# EasyEDA Pro project 串口模块.epro, schematic 车载普通串口V1
Board Name: 车载普通串口V1; Create Date: 2025-07-07; Page Name: P1; Project Name: 串口模块（普通串口未开发）; Schematic Name: 车载普通串口V1; Update Date: 2025-07-07; Company: 嘉立创EDA; Page Size: A4; Version: V1.0
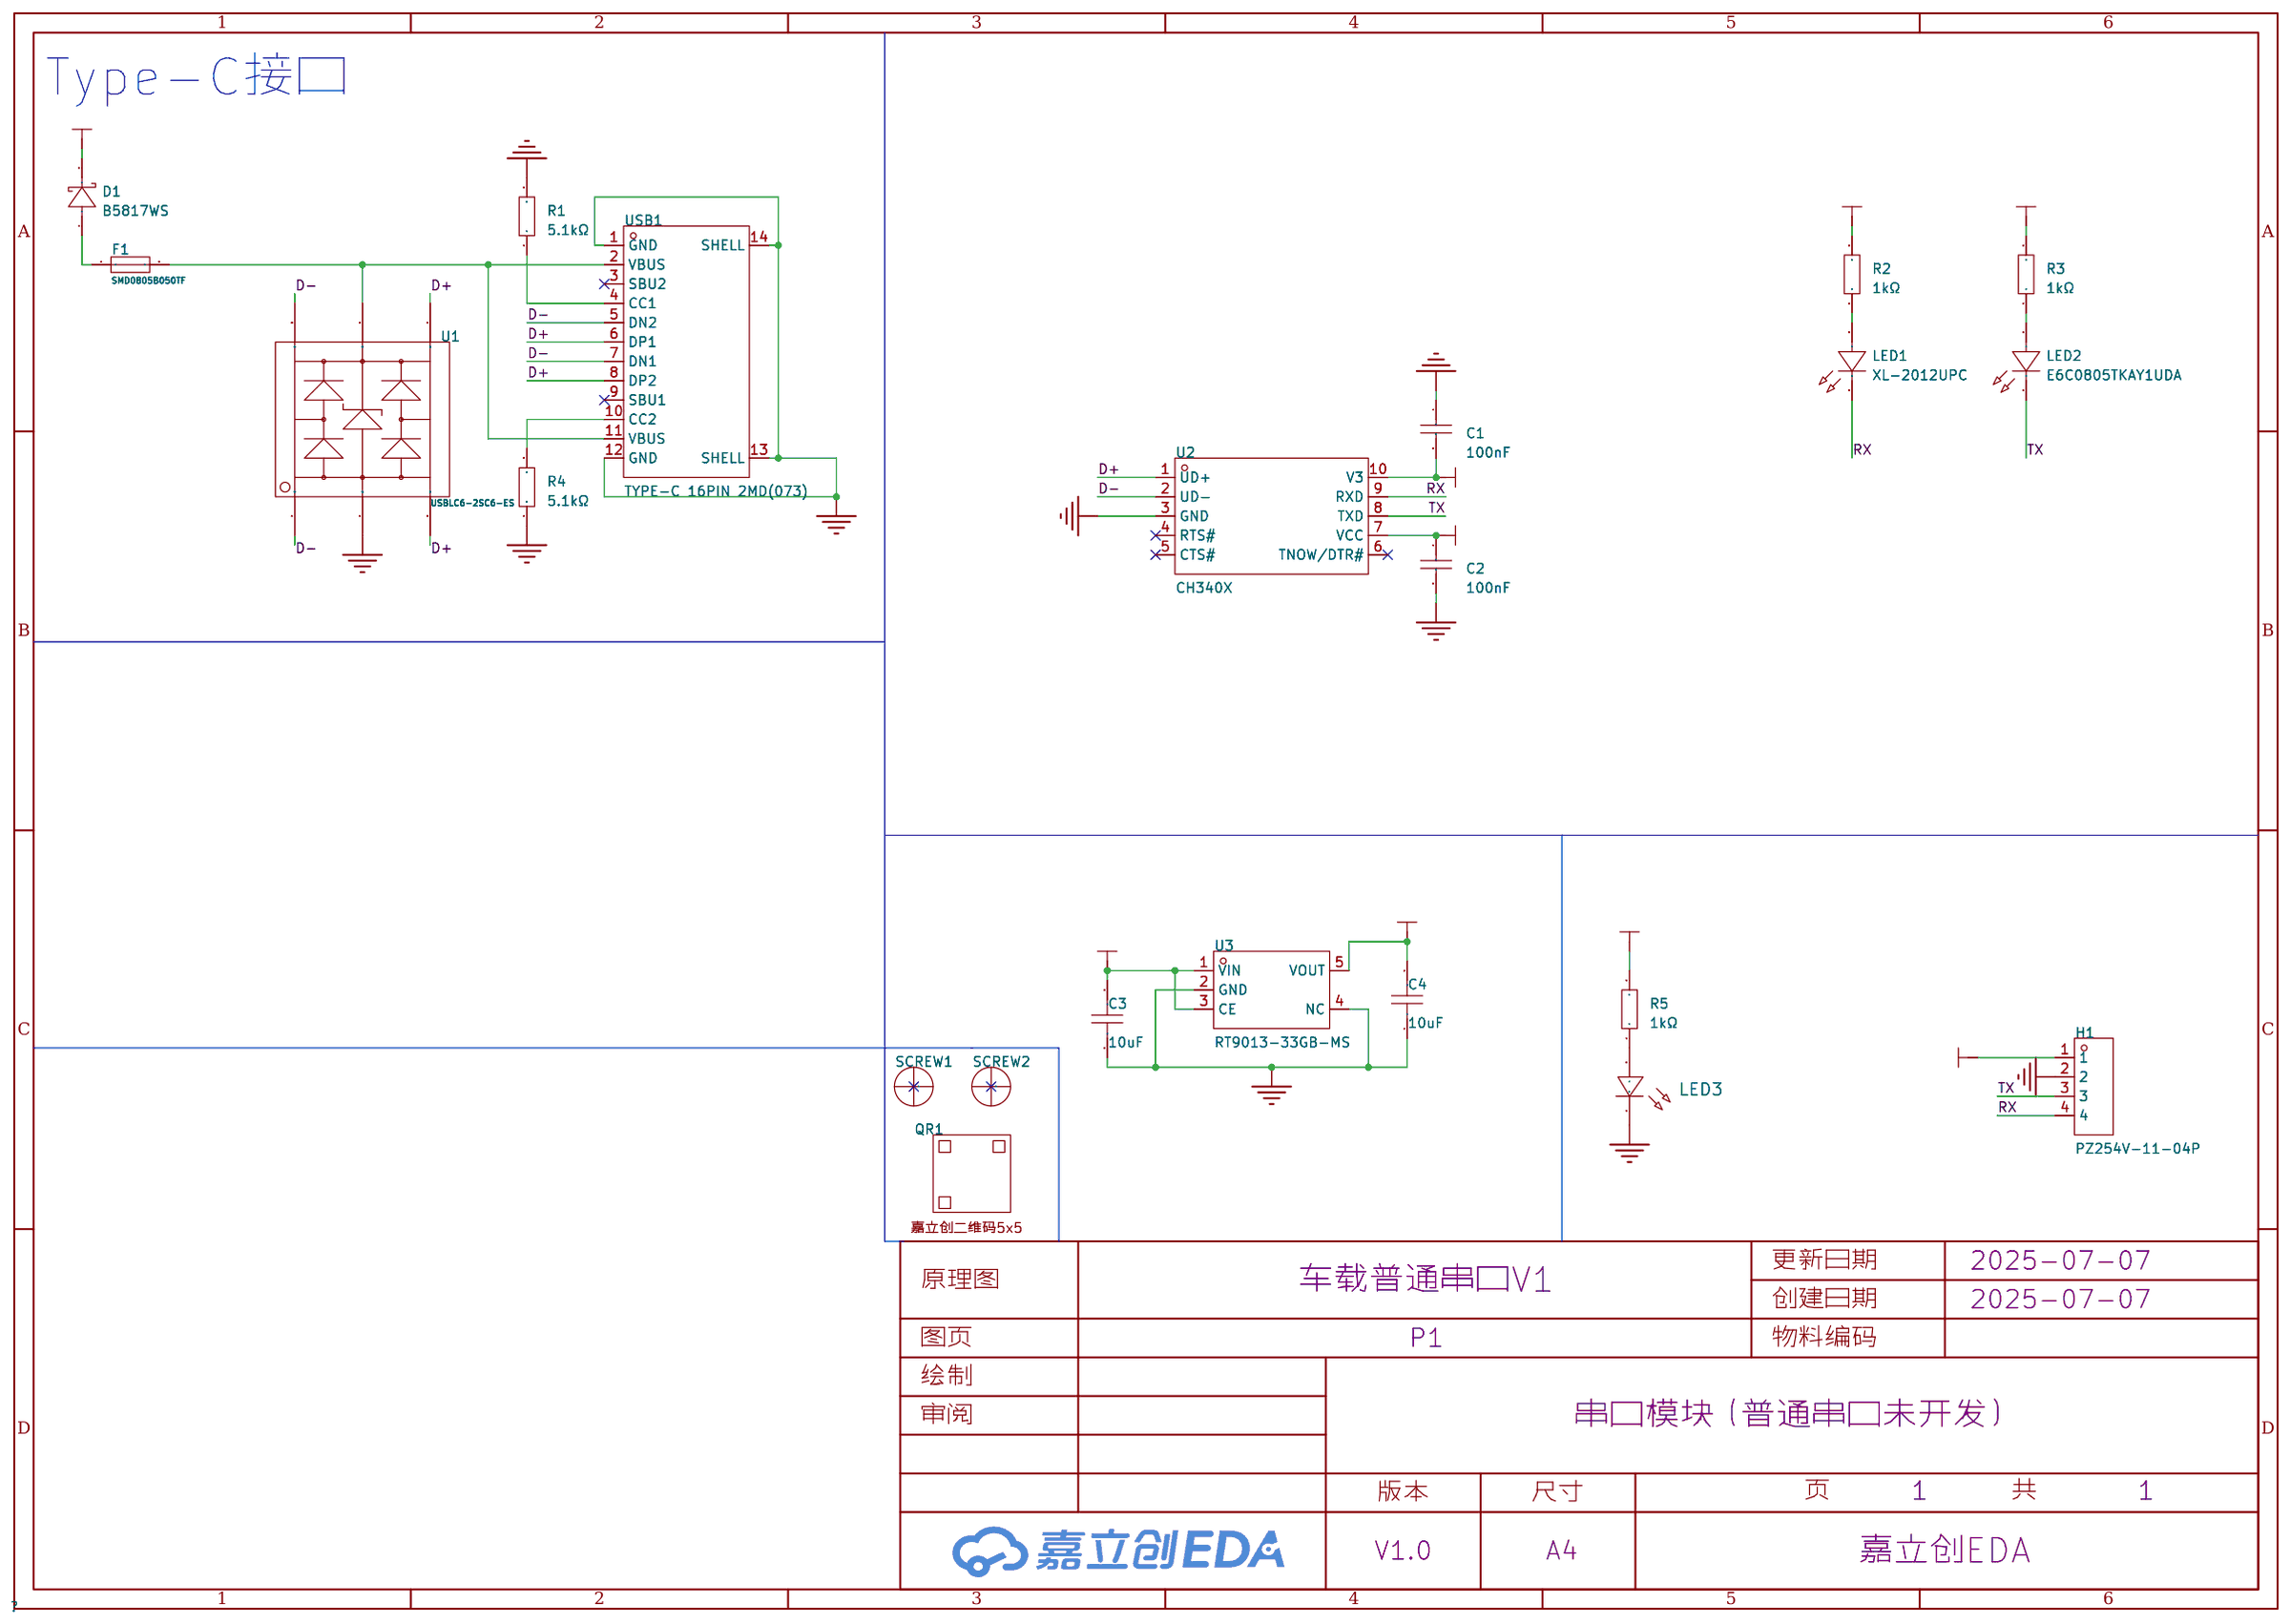
[diagram p1: schematic sheet]

## Parts
C1  100nF  [C0603]
C2  100nF  [C0603]
C3  10uF  [C0805]
C4  10uF  [C0805]
D1  B5817WS  [SOD-323_L1.7-W1.3-LS2.5-FD]
F1  SMD0805B050TF  [F0805]
H1  PZ254V-11-04P  [HDR-TH_4P-P2.54-V-M]
LED1  XL-2012UPC  [LED0805-RD_PINK]
LED2  E6C0805TKAY1UDA  [LED0805-RD_BLUE]
LED3  XL-1608SURC-06  [LED0603-RD_RED]
QR1  -  [JLC-QRCODE-5x5]
R1  5.1kΩ  [R0603]
R2  1kΩ  [R0805]
R3  1kΩ  [R0805]
R4  5.1kΩ  [R0603]
R5  1kΩ  [R0805]
SCREW1  -  [M2螺丝]
SCREW2  -  [M2螺丝]
U1  USBLC6-2SC6-ES  [SOT-23-6_L2.9-W1.6-P0.95-LS2.8-BR]
U2  CH340X  [MSOP-10_L3.0-W3.0-P0.50-LS5.0-BL]
U3  RT9013-33GB-MS  [SOT-23-5_L2.9-W1.6-P0.95-LS2.8-BR]
USB1  TYPE-C 16PIN 2MD(073)  [USB-C-SMD_TYPE-C-6PIN-2MD-073]

## Library data of the parts
C1 C2 = CC0603KRX7R9BB104: 容值:100nF;精度:±10%;额定电压:50V;材质(温度系数):X7R;; LCSC Part Name: 100nF ±10% 50V; Supplier Part: C14663; Manufacturer: YAGEO(国巨); Supplier Footprint: 0603; JLCPCB Part Class: 基础库; Datasheet: https://atta.szlcsc.com/upload/public/pdf/source/20180910/C282072_33301C7F631E79921B82A8DAC6BCC5B3.pdf; Supplier: LCSC; Tolerance: ±10%; Voltage Rated: 50V; Temperature Coefficient: X7R
C3 C4 = GRM21BR61H106KE43L: 容值:10uF;精度:±10%;额定电压:50V;材质(温度系数):X5R;; LCSC Part Name: 10uF ±10% 50V; Supplier Part: C440198; Manufacturer: muRata(村田); Supplier Footprint: 0805; JLCPCB Part Class: 基础库; Datasheet: https://atta.szlcsc.com/upload/public/pdf/source/20230811/95AAE0C9AF55EDC31B7A4D8B733F534E.pdf; Supplier: LCSC; Tolerance: ±10%; Voltage Rated: 50V; Temperature Coefficient: X5R
D1 = B5817WS_C7420329: 二极管配置:独立式;正向压降(Vf):450mV@1.0A;直流反向耐压(Vr):20V;平均整流电流(Io):1A;; LCSC Part Name: 电压:20V 电流:1A; Supplier Part: C7420329; Manufacturer: 宏迦橙; Supplier Footprint: SOD-323; JLCPCB Part Class: Extended Part; Datasheet: https://atta.szlcsc.com/upload/public/pdf/source/20230828/03CA0F4F90DAE368A7153B7B5E4D0651.pdf; Supplier: LCSC; Diode Configuration: 独立式; Forward Voltage (Vf@If): 450mV@1.0A; Reverse Voltage (Vr): 20V; Average Rectified Current (Io): 1A; Reverse Leakage Current (Ir): 1mA@20V
F1 = SMD0805B050TF: 最大电压:6V;最大电流:100A;保持电流:500mA;跳闸电流:1A;; LCSC Part Name: 6V 500mA 0805自恢复; Supplier Part: C269104; Manufacturer: Brightking(君耀电子); Supplier Footprint: 0805; JLCPCB Part Class: 扩展库; Datasheet: https://atta.szlcsc.com/upload/public/pdf/source/20180913/C269107_1BF28CF6F4C5BFD5B8CD673BC8D2B923.pdf; Supplier: LCSC; Operating Voltage (Max): 6V; Current Rating (Max): 100A; Hold Current: 500mA; Trip Current: 1A; Resistance - Initial (Ri) (Min): 150mΩ; Maximum Time to Trip: 100ms; Operating Temperature: -40℃~+85℃；-40℃~+85℃；-40℃~+85℃
H1 = PZ254V-11-04P: 插针结构:1x4P;间距:2.54mm;行距:-;圆针/方针:方针;安装类型:直插;排数:单排;总PIN位数:4P;额定电流:3A;额定电压:250V;配合针长度:6mm;塑高:2.5mm;端接针长度:3mm;触头材质:-;工作温度范围:-40℃~+105℃;颜色:黑色;; LCSC Part Name: 间距:2.54mm 1x4P 直插 方针; Supplier Part: C2691448; Manufacturer: XFCN(兴飞); Supplier Footprint: 插件,P=2.54mm; JLCPCB Part Class: 扩展库; Datasheet: https://atta.szlcsc.com/upload/public/pdf/source/20200309/C492403_F9F19131791D08044AD4F84F8E751A34.pdf; Supplier: LCSC; Pin Structure: 1x4P; Pitch: 2.54mm; Circluar Pins/Square Pins: 方针; Mounting Type: 直插; Number of Rows: 单排; Number of Pins: 4P; Current Rating (Max): 3A; Voltage Rating (Max): 250V; Length of Mating Pin: 6mm; Insulation Height: 2.5mm; Length of End Connection Pin: 3mm; Operating Temperature Range: -40℃~+105℃; Color: 黑色
LED1 = XL-2012UPC: 灯头类型:-;发光颜色:粉色;正向电压(VF):3.3V;功率:70mW;正向电流:20mA;主波长:-;二极管配置:-;透镜颜色:-;色温:-;发光强度:303mcd;发光角度:120°;载带方式:正贴;工作温度:-20℃~+85℃;; Supplier Part: C965821; Manufacturer: XINGLIGHT(成兴光); Supplier Footprint: 0805; JLCPCB Part Class: 扩展库; Datasheet: https://atta.szlcsc.com/upload/public/pdf/source/20240218/A96AF37DA93958101EC7A9E354C28E93.pdf; Supplier: LCSC; Emitted Color: 粉色; Forward Voltage (VF): 3.3V; Power Dissipation: 70mW; Forward Current: 20mA; Luminous Intensity: 303mcd; Viewing Angle: 120°; Mounting Sytle: 正贴; Operating Temperature: -20℃~+85℃
LED2 = E6C0805TKAY1UDA: 发光颜色:冰蓝色;功率:-;正向电流:20mA;主波长:-;二极管配置:-;透镜颜色:雾状黄透镜;色温:-;发光角度:120°;载带方式:-;工作温度:-40℃~+90℃;; LCSC Part Name: E6C0805TKAY1UDA 冰蓝/天空蓝; Supplier Part: C2859407; Manufacturer: ekinglux(亿晶源); Supplier Footprint: 0805; JLCPCB Part Class: 扩展库; Datasheet: https://atta.szlcsc.com/upload/public/pdf/source/20210823/60EDF97C974DD75042409A5350B827A6.pdf; Supplier: LCSC; Emitted Color: 冰蓝色; Forward Current: 20mA; Lens Color: 雾状黄透镜; Viewing Angle: 120°; Operating Temperature: -40℃~+90℃
LED3 = XL-1608SURC-06: 发光颜色:红色;功率:55mW;正向电流:25mA;主波长:617nm~621nm;透镜颜色:无色透明透镜;色温:-;发光角度:120°;载带方式:正贴;工作温度:-30℃~+85℃;; Supplier Part: C965799; Manufacturer: XINGLIGHT(成兴光); Supplier Footprint: 0603; JLCPCB Part Class: Extended Part; Datasheet: https://atta.szlcsc.com/upload/public/pdf/source/20221102/D860AFDD1CDB02C5A8064103A32707E2.pdf; Supplier: LCSC; Emitted Color: 红色; Power Dissipation: 55mW; Forward Current: 25mA; Dominant Wavelength: 617nm~621nm; Peak Wavelength: 623nm; Lens Color: 无色透明透镜; Viewing Angle: 120°; Mounting Sytle: 正贴; Operating Temperature: -30℃~+85℃
QR1 = 嘉立创二维码5x5: Check: false
R1 R4 = 0603WAF5101T5E: 电阻类型:厚膜电阻;阻值:5.1kΩ;精度:±1%;功率:100mW;最大工作电压:75V;温度系数:±100ppm/℃;; LCSC Part Name: 5.1kΩ ±1% 100mW 厚膜电阻; Supplier Part: C23186; Manufacturer: UNI-ROYAL(厚声); Supplier Footprint: 0603; JLCPCB Part Class: 基础库; Datasheet: https://atta.szlcsc.com/upload/public/pdf/source/20200306/C422600_1E6D84923E4A46A82E41ADD87F860B5C.pdf; Supplier: LCSC; Type: 厚膜电阻; Tolerance: ±1%; Power(Watts): 100mW; Overload Voltage (Max): 75V; Temperature Coefficient: ±100ppm/℃; Operating Temperature Range: -55℃~+155℃
R2 R3 R5 = 0805W8F1001T5E: 电阻类型:厚膜电阻;阻值:1kΩ;精度:±1%;功率:125mW;最大工作电压:150V;温度系数:±100ppm/℃;; LCSC Part Name: 1kΩ ±1% 125mW 厚膜电阻; Supplier Part: C17513; Manufacturer: UNI-ROYAL(厚声); Supplier Footprint: 0805; JLCPCB Part Class: 基础库; Datasheet: https://atta.szlcsc.com/upload/public/pdf/source/20200306/C422600_1E6D84923E4A46A82E41ADD87F860B5C.pdf; Supplier: LCSC; Type: 厚膜电阻; Tolerance: ±1%; Power(Watts): 125mW; Overload Voltage (Max): 150V; Temperature Coefficient: ±100ppm/℃; Operating Temperature Range: -55℃~+155℃
SCREW1 SCREW2 = M2螺丝: Check: false
U1 = USBLC6-2SC6-ES: 极性:单向;反向截止电压(Vrwm):5V;钳位电压:15V;峰值脉冲电流(Ipp):4.5A;峰值脉冲功率(Ppp):-;击穿电压:6V;; LCSC Part Name: 2路单向+带VBUS防护ESD静电防护器件，20kV，CJ：0.6pF；HDMI/USB/RJ45高速接口通讯防护; Supplier Part: C5180249; Manufacturer: ElecSuper(静芯); Supplier Footprint: SOT23-6; JLCPCB Part Class: Extended Part; Datasheet: https://atta.szlcsc.com/upload/public/pdf/source/20250407/0D83F2EDAE29466592232821585C4EDC.pdf; Supplier: LCSC; polarity: 单向; Reverse Stand-Off Voltage (Vrwm): 5V; Maximum Clamping Voltage: 15V; Peak Pulse Current (Ipp): 4.5A; Breakdown Voltage: 6V; Reverse Leakage Current (Ir): 1uA; Number of Lines: 双路; Type: ESD; Polarity: 单向; Clamping Voltage: 15V; Voltage - Breakdown: 6V; Number of Channels: 双路
U2 = CH340X: Supplier Part: C3035748; Manufacturer: WCH(南京沁恒); Supplier Footprint: MSOP-10; JLCPCB Part Class: 扩展库; Datasheet: https://atta.szlcsc.com/upload/public/pdf/source/20230530/6E401E9554E9F5311886CC8B3F89B62E.pdf; Supplier: LCSC
U3 = RT9013-33GB-MS: 输出类型:固定;最大输入电压:5.5V;输出电压:3.3V;最大输出电流:500mA;电源纹波抑制比(PSRR):75dB@(1kHz);输出极性:正极;; Supplier Part: C7434207; Manufacturer: MSKSEMI(美森科); Supplier Footprint: SOT-23-5; Datasheet: https://atta.szlcsc.com/upload/public/pdf/source/20230705/1D6536D82D93AC1E044F3DAE104751D9.pdf; Supplier: LCSC; Output Type: 固定; Maximum Input Voltage: 5.5V; Output Voltage: 3.3V; MAX Output Current: 500mA; Power Supply Rejection Ratio (PSRR): 75dB@(1kHz); Output Polarity: 正极
USB1 = TYPE-C 16PIN 2MD(073): 连接器类型:Type-C;标准:USB 3.1;公母:母;安装方式:卧贴;触点数量:16P;端口数量:1;额定电流 - 电源:5A;工作温度范围:-25℃~+85℃;; LCSC Part Name: Type-C 母 卧贴; Supplier Part: C2765186; Manufacturer: SHOU HAN(首韩); Supplier Footprint: SMD; Datasheet: https://atta.szlcsc.com/upload/public/pdf/source/20211123/39B17C16241EAC15C5E277BDA434118E.pdf; Supplier: LCSC; Connector Type: Type-C; Standard: USB 3.1; Gender: 母; Mounting Style: 卧贴; Number of Contacts: 16P; Number of Ports: 1; Current Rating - Power (Max): 5A; Operating Temperature Range: -25℃~+85℃; Rated Voltage (Max): 5V; Connect-Disconnect Life: 5千次; Core Colour: 黑色

## Nets
3V3: C1.2 C2.1 C4.2 R2.2 R3.2 U2.7(VCC) U2.10(V3) U3.5(VOUT)
GND: C1.1 C2.2 C3.1 C4.1 H1.2 LED3.1(C) R1.2 R4.1 U1.2(GND) U2.3(GND) U3.2(GND) U3.4(NC) USB1.1(GND) USB1.12(GND) USB1.13(SHELL) USB1.14(SHELL)
VIN: C3.2 D1.2(K) H1.1 R5.2 U3.1(VIN) U3.3(CE)
D+: U1.3(I/O2) U1.4(I/O2) U2.1(UD+) USB1.6(DP1) USB1.8(DP2)
D-: U1.1(I/O1) U1.6(I/O1) U2.2(UD-) USB1.5(DN2) USB1.7(DN1)
RX: H1.4 LED1.1(K) U2.9(RXD)
TX: H1.3 LED2.1(K) U2.8(TXD)
$1N3665: F1.2 U1.5(VCC) USB1.2(VBUS) USB1.11(VBUS)
$1N11056: R4.2 USB1.10(CC2)
$1N11061: R1.1 USB1.4(CC1)
$1N12744: D1.1(A) F1.1
$1N22123: LED3.2(A) R5.1
$1N22217: LED1.2(A) R2.1
$1N22362: LED2.2(A) R3.1

Not connected (* = marked no-connect by the designer): SCREW1 1*; SCREW2 1*; U2 4(RTS#)* 5(CTS#)* 6(TNOW/DTR#)*; USB1 3(SBU2)* 9(SBU1)*

## Notes on the sheet
- Type-C接口
